# EAGLE design Pedal PCB (EAGLE 9.6.2)
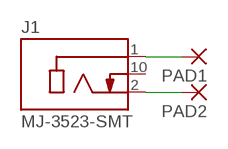
[diagram p0: schematic, sheet 1]

## Parts
J1  MJ-3523-SMT  [CUI_MJ-3523-SMT]
PAD1  SMD2  [SMD1,27-2,54]
PAD2  SMD2  [SMD1,27-2,54]

## Nets
N$1: J1.1 PAD1.1(P)
N$2: J1.2 PAD2.1(P)
Unconnected: J1.10

## Library data of the parts
J1 = MJ-3523-SMT:MJ-3523-SMT: 3.5 mm, Mono, Right Angle, Surface Mount (SMT), Audio Jack Connector; MANUFACTURER: CUI INC; PART_REV: D; STANDARD: MANUFACTURER RECOMMENDATIONS
PAD1 PAD2 = wirepad:SMD2: SMD PAD

## Board
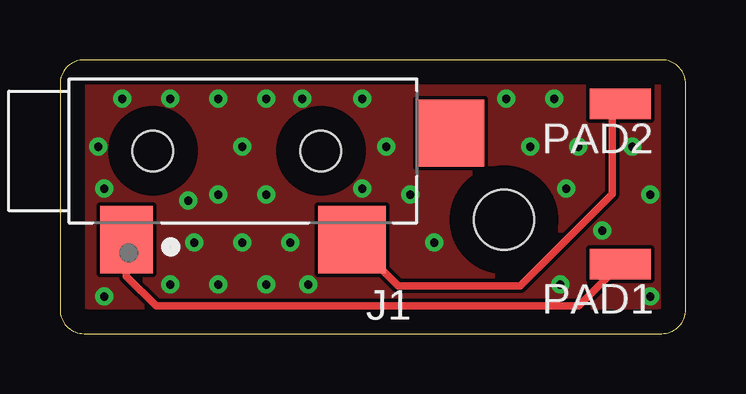
[diagram p1: board, top side]
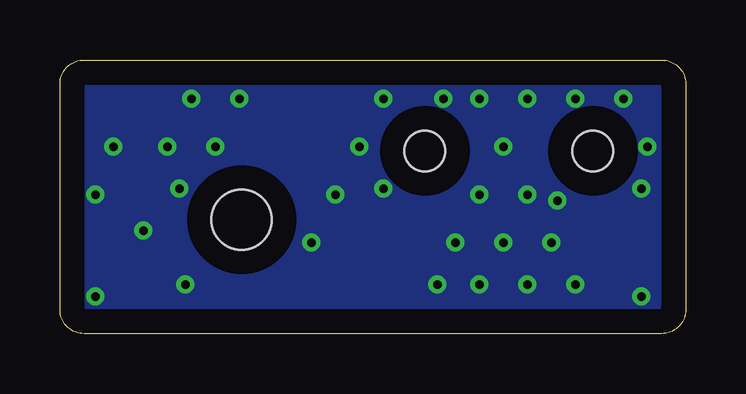
[diagram p2: board, bottom side, seen from below]

Size 26.07 x 11.42 mm. Coordinates in mm from the lower left corner, seen from the top.
Outline: 0,10.42 0,1 arc90 1,0 25.07,0 arc90 26.07,1 26.07,10.42 arc90 25.07,11.42 1,11.42 arc90 0,10.42
Copper layers (1*16): Top 0.035mm / dielectric 1.5mm / Bottom 0.035mm
Design rules "default": minimum track width 6mil, minimum drill 0.35mm, track to track 6mil, track to pad 6mil, pad to pad 6mil, via to via 6mil, smd to smd 6mil, copper to edge 40mil, drill to drill 6mil, minimum pad ring 10mil, minimum via ring 8mil, stop-mask expansion 4mil, vias tented up to drill 0.5mm, thermal gap 10mil
Holes 2.5 mm at 18.5,4.75

### Footprints (pad centres in the part's own frame; a part is rotated, then mirrored left to right if it is on the bottom)
CUI_MJ-3523-SMT = smd 2.2 x 2.8: 1 4.85,3.7 | smd 2.8 x 2.8: 2 -4.55,3.7; 10 -8.65,-0.75 | hole 1.7: 3.75,0; -3.25,0
SMD1,27-2,54 = smd 1.27 x 2.54: 1 0,0

### Placement (x,y rotation side)
J1  7.62,7.62 180 top
PAD1  23.34,2.89 90 top
PAD2  23.34,9.58 90 top

### Tracks (layer width: path | path; a pad name or v marks a point on that pad's centre or on a via)
GND  (via drill 0.35)
  other vias: 1.84,1.55 1.84,6.05 1.59,7.8 2.6,9.8 4.59,2.05 5.34,5.55 4.59,9.8 6.59,2.05 5.59,3.8 6.59,5.8 6.59,9.8 8.6,2.05 7.59,3.8 8.6,5.8 7.59,7.8 8.6,9.8 10.35,2.05 9.6,3.8 10.1,9.8 12.6,6.05 12.6,9.8 14.6,5.8 13.6,7.8 15.6,3.8 18.59,9.8 20.84,2.05 21.09,6.05 19.59,7.8 20.59,9.8 22.59,4.3 21.59,7.8 24.59,1.55 24.59,5.8 23.84,7.8
  pour Top: 0,0 25,0 arc90 26,1 26,11 arc90 25.5,11.5 24.75,11.5 1,11.5 arc90 0,10.5
  pour Bottom: 0,0 25,0 arc90 26,1 26,11.5 1,11.5 arc90 0,10.5
N$1
  Top 0.305: 3,4.15 J1.1 2.77,2.4 4,1.17 21.62,1.17 PAD1.1
N$2
  Top 0.305: J1.2 14.09,2 19.17,2 23,5.83 23,9.24 PAD2.1